# EAGLE design FIREFLIES 2032 LDR (EAGLE 7.3.0)
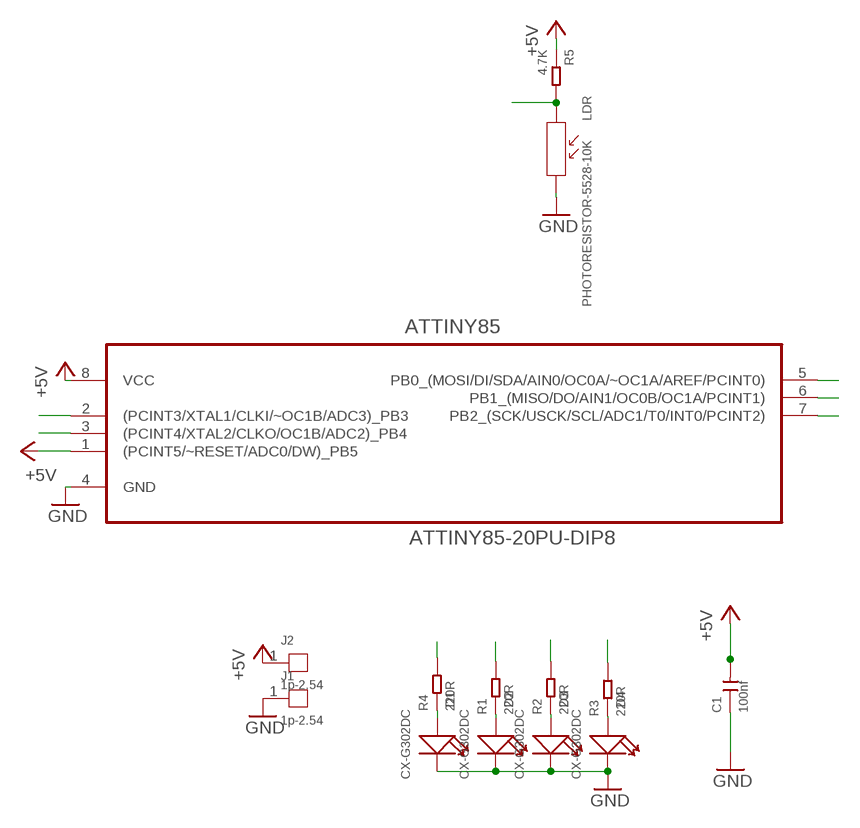
[diagram p0: schematic, sheet 1]

## Parts
ATTINY85  ATTINY85-20PU-DIP8  MCU-ATTINY85-20PU(DIP8)1  [DIP254P762X533-8]
C1  100nf  DIP-CERAMIC-DISC-100NF-50V-Y5V(D5.0MM)  [CERAMIC-2.54]
D1  CX-G302DC  DIP-LED-GREEN-GREEN(2P-D3MM)  [LED2-2.54-D3.0MM]
D2  CX-G302DC  DIP-LED-GREEN-GREEN(2P-D3MM)  [LED2-2.54-D3.0MM]
D3  CX-G302DC  DIP-LED-GREEN-GREEN(2P-D3MM)  [LED2-2.54-D3.0MM]
D4  CX-G302DC  DIP-LED-GREEN-GREEN(2P-D3MM)  [LED2-2.54-D3.0MM]
J1  1p-2.54  DIP-BLACK-ROUND-FEMALE-HEADER-VERT(1P-2.54)  [1P-65/35MIL]
J2  1p-2.54  DIP-BLACK-ROUND-FEMALE-HEADER-VERT(1P-2.54)  [1P-65/35MIL]
LDR  PHOTORESISTOR-5528-10K  PHOTORESISTOR-5528-10K(2P-5.0X4.2MM)  [SNR2-3.0]
R1  220R  DIP-RES-220R-5%-1/4W(PR-D2.3XL6.5MM)  [PR-D2.3XL6.5MM]
R2  220R  DIP-RES-220R-5%-1/4W(PR-D2.3XL6.5MM)  [PR-D2.3XL6.5MM]
R3  220R  DIP-RES-220R-5%-1/4W(PR-D2.3XL6.5MM)  [PR-D2.3XL6.5MM]
R4  220R  DIP-RES-220R-5%-1/4W(PR-D2.3XL6.5MM)  [PR-D2.3XL6.5MM]
R5  4.7K  DIP-RES-4.7K-5%-1/4W(PR-D2.3XL6.5MM)  [PR-D2.3XL6.5MM]

## Nets
+5V: ATTINY85.1((PCINT5/~RESET/ADC0/DW)_PB5) ATTINY85.8(VCC) C1.2 J2.1 R5.1
A1: ATTINY85.7(PB2_(SCK/USCK/SCL/ADC1/T0/INT0/PCINT2)) LDR.1 R5.2
A2: ATTINY85.3((PCINT4/XTAL2/CLKO/OC1B/ADC2)_PB4) R2.2
A3: ATTINY85.2((PCINT3/XTAL1/CLKI/~OC1B/ADC3)_PB3) R1.2
D0: ATTINY85.5(PB0_(MOSI/DI/SDA/AIN0/OC0A/~OC1A/AREF/PCINT0)) R3.2
D1: ATTINY85.6(PB1_(MISO/DO/AIN1/OC0B/OC1A/PCINT1)) R4.2
GND: ATTINY85.4(GND) C1.1 D1.K(-) D2.K(-) D3.K(-) D4.K(-) J1.1 LDR.2
N$3: D2.A(+) R1.1
N$4: D1.A(+) R4.1
N$5: D3.A(+) R2.1
N$6: D4.A(+) R3.1

## Library data of the parts
ATTINY85 = Seeed-OPL-ic:MCU-ATTINY85-20PU(DIP8): 310010112; MPN: ATTINY85-20PU
C1 = Seeed-OPL-Capacitor:DIP-CERAMIC-DISC-100NF-50V-Y5V(D5.0MM): 302010208; MPN: CC1-F5SL2A101KSPW
D1-D4 = Seeed-OPL-Diode:DIP-LED-GREEN-GREEN(2P-D3MM): 304090040; MPN: CX-G302DC
J1 J2 = Seeed-OPL-Connector:DIP-BLACK-ROUND-FEMALE-HEADER-VERT(1P-2.54): 320030026; MPN: RF130-1013BBS0741
LDR = Seeed-OPL-sensor:PHOTORESISTOR-5528-10K(2P-5.0X4.2MM): 314020017; MPN: PHOTORESISTOR-5528-10K
R1-R4 = Seeed-OPL-Resistor:DIP-RES-220R-5%-1/4W(PR-D2.3XL6.5MM): 301020011; MPN: FHCFR-1/4W-221J
R5 = Seeed-OPL-Resistor:DIP-RES-4.7K-5%-1/4W(PR-D2.3XL6.5MM): 301020012; MPN: FHCFR-1/4W-472J

## Board
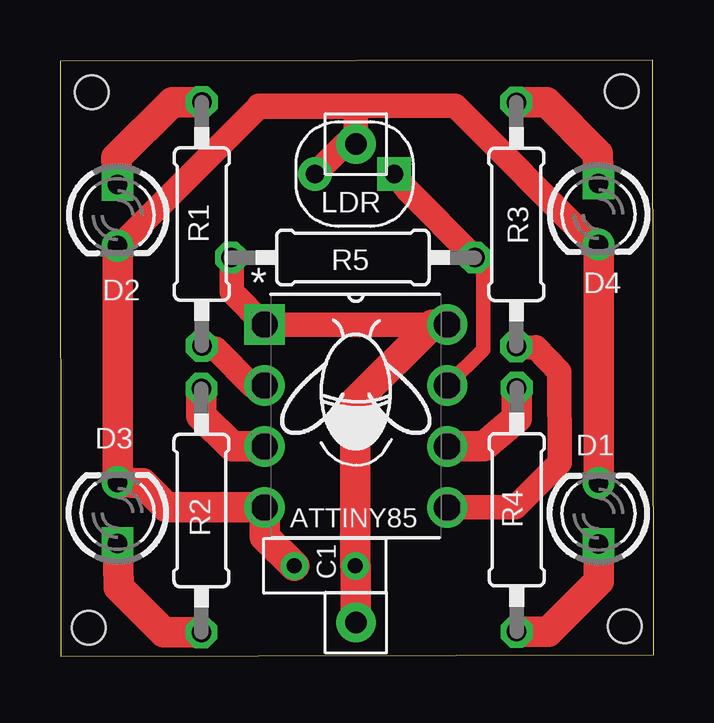
[diagram p1: board, top side]

Size 24.73 x 24.84 mm. Coordinates in mm from the lower left corner, seen from the top.
Outline: 0.03,0 24.73,0.05 24.7,24.84 0,24.79 0.03,0
Copper layers (1*16): Top 0.035mm / dielectric 1.5mm / Bottom 0.035mm
Design rules "SeeedStudio_2layer_DRU_no_angle_20140221": minimum track width 6mil, minimum drill 12mil, track to track 6mil, track to pad 6mil, pad to pad 6mil, via to via 6mil, smd to smd 0mil, copper to edge 10mil, drill to drill 10mil, minimum pad ring 10mil, minimum via ring 6mil, stop-mask expansion 2mil, vias tented up to drill 100mil, thermal gap 10mil
Holes 1.4 mm at 23.4,23.54 1.2,1.18 23.53,1.24 1.33,23.49

### Footprints (pad centres in the part's own frame; a part is rotated, then mirrored left to right if it is on the bottom)
DIP254P762X533-8 = drill 1.118 square: 1 -7.62,7.62 | drill 1.118: 2 -7.62,5.08; 3 -7.62,2.54; 4 -7.62,0; 5 0,0; 6 0,2.54; 7 0,5.08; 8 0,7.62
CERAMIC-2.54 = drill 0.635 pad 1.143: 1 -1.27,0; 2 1.27,0
LED2-2.54-D3.0MM = drill 0.813 square: A -1.27,0 | drill 0.813: K 1.27,0
1P-65/35MIL = drill 0.889 pad 1.651: 1 0,0
SNR2-3.0 = drill 0.762 pad 1.397 square: 1 -1.651,0 | drill 0.762 pad 1.397: 2 1.651,0
PR-D2.3XL6.5MM = drill 0.813 octagon: 1 -4.953,0; 2 5.207,0

### Placement (x,y rotation side)
ATTINY85  16.14,6.19 0 top
C1  11.03,3.76 0 top
D1  22.44,5.94 90 top
D2  2.4,18.37 270 top
D3  2.4,5.97 90 top
D4  22.44,18.42 270 top
J1  12.33,21.33 0 top
J2  12.33,1.39 0 top
LDR  12.27,20.09 180 top
R1  5.91,18.13 270 top
R2  5.89,5.94 90 top
R3  19.01,18.12 270 top
R4  19.03,5.97 90 top
R5  12.08,16.61 0 top

### Tracks (layer width: path | path; a pad name or v marks a point on that pad's centre or on a via)
+5V
  Top 1.016: ATTINY85.8 15.5,13.81 ATTINY85.1 7.15,15.18 7.15,16.58 R5.1
  Top 1.27: ATTINY85.8 15.89,13.81 | J2.1 12.33,3.73 C1.2 12.3,10.61 15.5,13.81
A1
  Top 0.61: ATTINY85.7 16.14,11.29 17.64,12.76 17.64,16.14 17.37,16.57 R5.2
  Top 1.016: R5.2 14.47,19.42 LDR.1
A2
  Top 1.27: ATTINY85.3 7.18,8.73 5.89,10.02 R2.2
A3
  Top 1.016: ATTINY85.2 8.01,11.27 6.49,12.8 5.85,12.8 R1.2
D0
  Top 1.016: ATTINY85.5 18.97,6.19 20.82,8.05 20.79,11.86 19.82,12.86 19.03,12.85 R3.2
D1
  Top 1.27: R4.2 19.03,9.9 17.66,8.73 ATTINY85.6
GND
  Top 1.016: D2.K 2.41,17.11 2.52,17.11 8.29,22.88 | 8.29,22.88 8.33,22.92 | D4.K 22.24,17.14 16.46,22.92 8.29,22.92 8.29,22.88 | 8.29,22.88 12.29,22.88 12.33,22.84 J1.1 11.87,21.33 LDR.2
  Top 1.27: C1.1 8.52,4.97 ATTINY85.4 4.46,6.19 3.44,7.21 D3.K D2.K 2.42,17.11 | D1.K D4.K
N$3
  Top 1.27: R1.1 4.68,23.08 2.35,20.77 D2.A
N$4
  Top 1.27: R4.1 20.34,1.02 22.45,3.11 D1.A
N$5
  Top 1.27: R2.1 4.33,0.99 2.44,2.87 D3.A
N$6
  Top 1.27: R3.1 20.28,23.08 22.41,20.94 D4.A

### Text on the board
tNames: R5 | C:/Users/Jorge Trincado/Desktop/ff2.bmp
bNames: CR2032 | 3V | FireFlies